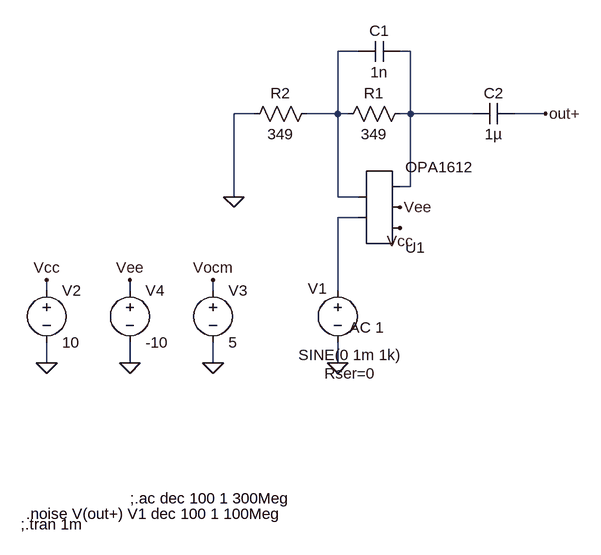
[diagram p0: schematic Draft1.asc]
Draft1.asc, the LTspice schematic file:
Version 4
SHEET 1 880 680
WIRE 208 -176 176 -176
WIRE 288 -176 272 -176
WIRE 48 -80 16 -80
WIRE 176 -80 176 -176
WIRE 176 -80 128 -80
WIRE 192 -80 176 -80
WIRE 288 -80 288 -176
WIRE 288 -80 272 -80
WIRE 384 -80 288 -80
WIRE 496 -80 448 -80
WIRE 288 32 288 -80
WIRE 288 32 272 32
WIRE 16 48 16 -80
WIRE 176 48 176 -80
WIRE 208 48 176 48
WIRE 208 80 176 80
WIRE -272 192 -272 176
WIRE -144 192 -144 176
WIRE -16 192 -16 176
WIRE 176 192 176 80
WIRE -272 304 -272 272
WIRE -144 304 -144 272
WIRE -16 304 -16 272
WIRE 176 304 176 272
FLAG -272 304 0
FLAG 496 -80 out+
FLAG -272 176 Vcc
FLAG -16 176 Vocm
FLAG -16 304 0
FLAG 272 96 Vcc
FLAG 176 304 0
FLAG 16 48 0
FLAG -144 304 0
FLAG -144 176 Vee
FLAG 272 64 Vee
SYMBOL voltage 176 176 M0
WINDOW 0 31 29 Bottom 2
WINDOW 3 -19 100 Top 2
WINDOW 123 -45 89 Bottom 2
WINDOW 39 -19 128 Top 2
SYMATTR InstName V1
SYMATTR Value SINE(0 1m 1k)
SYMATTR Value2 AC 1
SYMATTR SpiceLine Rser=0
SYMBOL voltage -272 176 R0
WINDOW 123 0 0 Left 2
WINDOW 39 0 0 Left 2
SYMATTR InstName V2
SYMATTR Value 10
SYMBOL voltage -16 176 R0
WINDOW 123 0 0 Left 2
WINDOW 39 0 0 Left 2
SYMATTR InstName V3
SYMATTR Value 5
SYMBOL cap 448 -96 R90
WINDOW 0 0 32 VBottom 2
WINDOW 3 32 32 VTop 2
SYMATTR InstName C2
SYMATTR Value 1µ
SYMBOL AutoGenerated\\OPA1612 240 64 M180
SYMATTR InstName U1
SYMBOL res 288 -96 R90
WINDOW 0 0 56 VBottom 2
WINDOW 3 32 56 VTop 2
SYMATTR InstName R1
SYMATTR Value 349
SYMBOL cap 272 -192 R90
WINDOW 0 0 32 VBottom 2
WINDOW 3 32 32 VTop 2
SYMATTR InstName C1
SYMATTR Value 1n
SYMBOL res 144 -96 R90
WINDOW 0 0 56 VBottom 2
WINDOW 3 32 56 VTop 2
SYMATTR InstName R2
SYMATTR Value 349
SYMBOL voltage -144 176 R0
WINDOW 123 0 0 Left 2
WINDOW 39 0 0 Left 2
SYMATTR InstName V4
SYMATTR Value -10
TEXT -144 512 Left 2 !;.ac dec 100 1 300Meg
TEXT -304 536 Left 2 !.noise V(out+) V1 dec 100 1 100Meg
TEXT -312 552 Left 2 !;.tran 1m

The netlist it stands for:
* Draft1.asc
V1 N003 0 SINE(0 1m 1k) AC 1 Rser=0
V2 Vcc 0 10
V3 Vocm 0 5
C2 out+ N002 1µ
* U1: OPA1612 (symbol AutoGenerated\OPA1612 not available, pins judged from their places): pin1=N003 pin2=N001 pin3=Vcc pin4=Vee pin5=N002
R1 N002 N001 349
C1 N002 N001 1n
R2 N001 0 349
V4 Vee 0 -10
;.ac dec 100 1 300Meg
.noise V(out+) V1 dec 100 1 100Meg
;.tran 1m
.backanno
.end